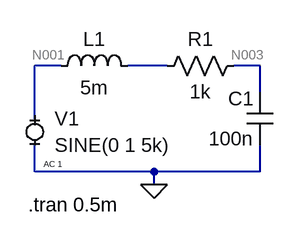
[diagram p0: schematic Draft5.asc]
Draft5.asc, the LTspice schematic file:
Version 4
SHEET 1 880 680
WIRE 128 112 96 112
WIRE 256 112 208 112
WIRE 368 112 336 112
WIRE 368 144 368 112
WIRE 96 176 96 112
WIRE 96 240 96 208
WIRE 240 240 96 240
WIRE 368 240 368 208
WIRE 368 240 240 240
WIRE 240 256 240 240
FLAG 240 256 0
SYMBOL MiniSyms4\\voltage- 96 192 R0
WINDOW 123 11 39 Left 0
WINDOW 39 0 0 Left 0
SYMATTR Value2 AC 1
SYMATTR InstName V1
SYMATTR Value SINE(0 1 5k)
SYMBOL ind 112 128 R270
WINDOW 0 32 56 VTop 2
WINDOW 3 5 56 VBottom 2
SYMATTR InstName L1
SYMATTR Value 5m
SYMBOL cap 384 208 R180
WINDOW 0 24 56 Left 2
WINDOW 3 24 8 Left 2
SYMATTR InstName C1
SYMATTR Value 100n
SYMBOL res 240 128 R270
WINDOW 0 32 56 VTop 2
WINDOW 3 0 56 VBottom 2
SYMATTR InstName R1
SYMATTR Value 1k
TEXT 88 280 Left 2 !.tran 0.5m

The netlist it stands for:
* Draft5.asc
V1 N001 0 SINE(0 1 5k) AC 1
L1 N001 N002 5m
C1 0 N003 100n
R1 N002 N003 1k
.tran 0.5m
.backanno
.end

* Results of the author's LTspice run, read from the files saved beside the schematic
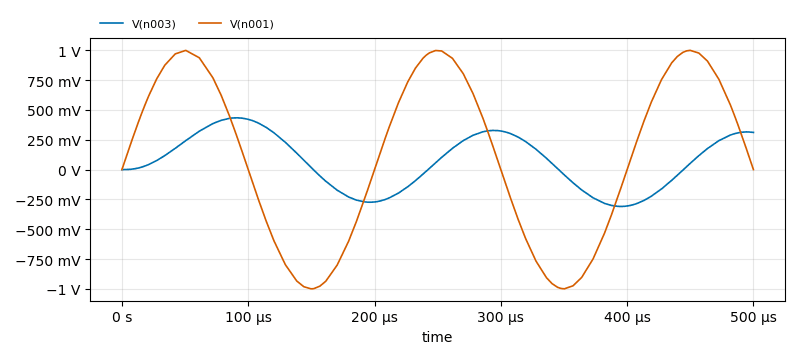
[diagram p1: Transient Analysis of Draft5.asc, plotted from the saved traces]
* Transient Analysis, 1 run:
*   V(n003): min -309.3 mV, max 434.2 mV, average 66.48 mV, rms 239 mV, last 311.9 mV
*   V(n001): min -999.9 mV, max 1 V, average 126.7 mV, rms 705.9 mV, last 0 V